# EAGLE design b295_rev0 (EAGLE 9.6.2)
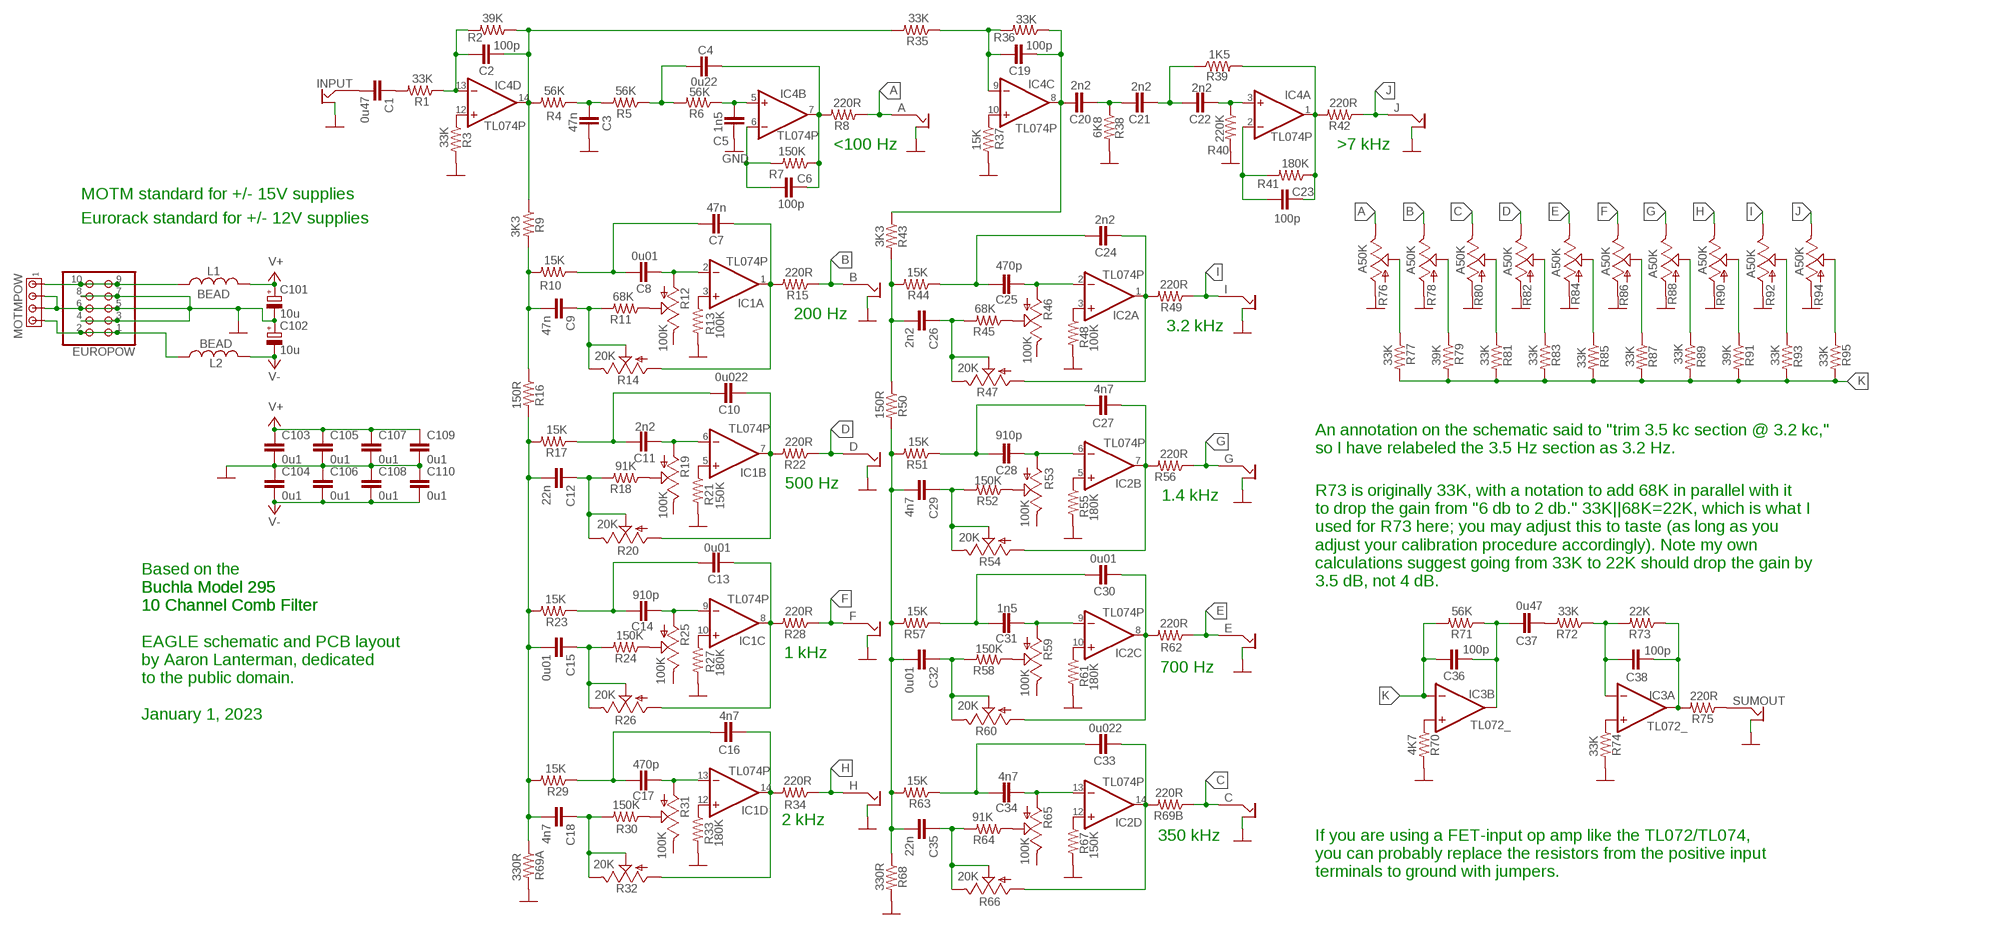
[diagram p0: schematic, sheet 1]

## Parts
A  OFFBOARD2JACKALT_AARON  [OFFBOARD2JACKALT]
B  OFFBOARD2JACKALT_AARON  [OFFBOARD2JACKALT]
C  OFFBOARD2JACKALT_AARON  [OFFBOARD2JACKALT]
C1  0u47  C-EU050-025X075-AARON  [C050-025X075-AARON]
C2  100p  C-EU050-025X075-AARON  [C050-025X075-AARON]
C3  47n  C-EU050-025X075-AARON  [C050-025X075-AARON]
C4  0u22  C-EU050-025X075-AARON  [C050-025X075-AARON]
C5  1n5  C-EU050-025X075-AARON  [C050-025X075-AARON]
C6  100p  C-EU050-025X075-AARON  [C050-025X075-AARON]
C7  47n  C-EU050-025X075-AARON  [C050-025X075-AARON]
C8  0u01  C-EU050-025X075-AARON  [C050-025X075-AARON]
C9  47n  C-EU050-025X075-AARON  [C050-025X075-AARON]
C10  0u022  C-EU050-025X075-AARON  [C050-025X075-AARON]
C11  2n2  C-EU050-025X075-AARON  [C050-025X075-AARON]
C12  22n  C-EU050-025X075-AARON  [C050-025X075-AARON]
C13  0u01  C-EU050-025X075-AARON  [C050-025X075-AARON]
C14  910p  C-EU050-025X075-AARON  [C050-025X075-AARON]
C15  0u01  C-EU050-025X075-AARON  [C050-025X075-AARON]
C16  4n7  C-EU050-025X075-AARON  [C050-025X075-AARON]
C17  470p  C-EU050-025X075-AARON  [C050-025X075-AARON]
C18  4n7  C-EU050-025X075-AARON  [C050-025X075-AARON]
C19  100p  C-EU050-025X075-AARON  [C050-025X075-AARON]
C20  2n2  C-EU050-025X075-AARON  [C050-025X075-AARON]
C21  2n2  C-EU050-025X075-AARON  [C050-025X075-AARON]
C22  2n2  C-EU050-025X075-AARON  [C050-025X075-AARON]
C23  100p  C-EU050-025X075-AARON  [C050-025X075-AARON]
C24  2n2  C-EU050-025X075-AARON  [C050-025X075-AARON]
C25  470p  C-EU050-025X075-AARON  [C050-025X075-AARON]
C26  2n2  C-EU050-025X075-AARON  [C050-025X075-AARON]
C27  4n7  C-EU050-025X075-AARON  [C050-025X075-AARON]
C28  910p  C-EU050-025X075-AARON  [C050-025X075-AARON]
C29  4n7  C-EU050-025X075-AARON  [C050-025X075-AARON]
C30  0u01  C-EU050-025X075-AARON  [C050-025X075-AARON]
C31  1n5  C-EU050-025X075-AARON  [C050-025X075-AARON]
C32  0u01  C-EU050-025X075-AARON  [C050-025X075-AARON]
C33  0u022  C-EU050-025X075-AARON  [C050-025X075-AARON]
C34  4n7  C-EU050-025X075-AARON  [C050-025X075-AARON]
C35  22n  C-EU050-025X075-AARON  [C050-025X075-AARON]
C36  100p  C-EU050-025X075-AARON  [C050-025X075-AARON]
C37  0u47  C-EU050-025X075-AARON  [C050-025X075-AARON]
C38  100p  C-EU050-025X075-AARON  [C050-025X075-AARON]
C101  10u  CPOL-EUE1.8-4  [E1,8-4]
C102  10u  CPOL-EUE1.8-4  [E1,8-4]
C103  0u1  C-EU050-025X075-AARON  [C050-025X075-AARON]
C104  0u1  C-EU050-025X075-AARON  [C050-025X075-AARON]
C105  0u1  C-EU050-025X075-AARON  [C050-025X075-AARON]
C106  0u1  C-EU050-025X075-AARON  [C050-025X075-AARON]
C107  0u1  C-EU050-025X075-AARON  [C050-025X075-AARON]
C108  0u1  C-EU050-025X075-AARON  [C050-025X075-AARON]
C109  0u1  C-EU050-025X075-AARON  [C050-025X075-AARON]
C110  0u1  C-EU050-025X075-AARON  [C050-025X075-AARON]
D  OFFBOARD2JACKALT_AARON  [OFFBOARD2JACKALT]
E  OFFBOARD2JACKALT_AARON  [OFFBOARD2JACKALT]
EUROPOW  PINHD-2X5  [2X05]
F  OFFBOARD2JACKALT_AARON  [OFFBOARD2JACKALT]
G  OFFBOARD2JACKALT_AARON  [OFFBOARD2JACKALT]
H  OFFBOARD2JACKALT_AARON  [OFFBOARD2JACKALT]
I  OFFBOARD2JACKALT_AARON  [OFFBOARD2JACKALT]
IC1  TL074P  [DIL14]
IC2  TL074P  [DIL14]
IC3  TL072_  [DIL08]
IC4  TL074P  [DIL14]
INPUT  OFFBOARD2JACKALT_AARON  [OFFBOARD2JACKALT]
J  OFFBOARD2JACKALT_AARON  [OFFBOARD2JACKALT]
L1  BEAD  L-US0207/10  [0207/10]
L2  BEAD  L-US0207/10  [0207/10]
MOTMPOW  MTA04-156  [1X4MTA]
R1  33K  R-US_0207/10  [0207/10]
R2  39K  R-US_0207/10  [0207/10]
R3  33K  R-US_0207/10  [0207/10]
R4  56K  R-US_0207/10  [0207/10]
R5  56K  R-US_0207/10  [0207/10]
R6  56K  R-US_0207/10  [0207/10]
R7  150K  R-US_0207/10  [0207/10]
R8  220R  R-US_0207/10  [0207/10]
R9  3K3  R-US_0207/10  [0207/10]
R10  15K  R-US_0207/10  [0207/10]
R11  68K  R-US_0207/10  [0207/10]
R12  100K  TRIM_US-B64Y  [B64Y]
R13  100K  R-US_0207/10  [0207/10]
R14  20K  TRIM_US-B64Y  [B64Y]
R15  220R  R-US_0207/10  [0207/10]
R16  150R  R-US_0207/10  [0207/10]
R17  15K  R-US_0207/10  [0207/10]
R18  91K  R-US_0207/10  [0207/10]
R19  100K  TRIM_US-B64Y  [B64Y]
R20  20K  TRIM_US-B64Y  [B64Y]
R21  150K  R-US_0207/10  [0207/10]
R22  220R  R-US_0207/10  [0207/10]
R23  15K  R-US_0207/10  [0207/10]
R24  150K  R-US_0207/10  [0207/10]
R25  100K  TRIM_US-B64Y  [B64Y]
R26  20K  TRIM_US-B64Y  [B64Y]
R27  180K  R-US_0207/10  [0207/10]
R28  220R  R-US_0207/10  [0207/10]
R29  15K  R-US_0207/10  [0207/10]
R30  150K  R-US_0207/10  [0207/10]
R31  100K  TRIM_US-B64Y  [B64Y]
R32  20K  TRIM_US-B64Y  [B64Y]
R33  180K  R-US_0207/10  [0207/10]
R34  220R  R-US_0207/10  [0207/10]
R35  33K  R-US_0207/10  [0207/10]
R36  33K  R-US_0207/10  [0207/10]
R37  15K  R-US_0207/10  [0207/10]
R38  6K8  R-US_0207/10  [0207/10]
R39  1K5  R-US_0207/10  [0207/10]
R40  220K  R-US_0207/10  [0207/10]
R41  180K  R-US_0207/10  [0207/10]
R42  220R  R-US_0207/10  [0207/10]
R43  3K3  R-US_0207/10  [0207/10]
R44  15K  R-US_0207/10  [0207/10]
R45  68K  R-US_0207/10  [0207/10]
R46  100K  TRIM_US-B64Y  [B64Y]
R47  20K  TRIM_US-B64Y  [B64Y]
R48  100K  R-US_0207/10  [0207/10]
R49  220R  R-US_0207/10  [0207/10]
R50  150R  R-US_0207/10  [0207/10]
R51  15K  R-US_0207/10  [0207/10]
R52  150K  R-US_0207/10  [0207/10]
R53  100K  TRIM_US-B64Y  [B64Y]
R54  20K  TRIM_US-B64Y  [B64Y]
R55  180K  R-US_0207/10  [0207/10]
R56  220R  R-US_0207/10  [0207/10]
R57  15K  R-US_0207/10  [0207/10]
R58  150K  R-US_0207/10  [0207/10]
R59  100K  TRIM_US-B64Y  [B64Y]
R60  20K  TRIM_US-B64Y  [B64Y]
R61  180K  R-US_0207/10  [0207/10]
R62  220R  R-US_0207/10  [0207/10]
R63  15K  R-US_0207/10  [0207/10]
R64  91K  R-US_0207/10  [0207/10]
R65  100K  TRIM_US-B64Y  [B64Y]
R66  20K  TRIM_US-B64Y  [B64Y]
R67  150K  R-US_0207/10  [0207/10]
R68  330R  R-US_0207/10  [0207/10]
R69A  330R  R-US_0207/10  [0207/10]
R69B  220R  R-US_0207/10  [0207/10]
R70  4K7  R-US_0207/10  [0207/10]
R71  56K  R-US_0207/10  [0207/10]
R72  33K  R-US_0207/10  [0207/10]
R73  22K  R-US_0207/10  [0207/10]
R74  33K  R-US_0207/10  [0207/10]
R75  220R  R-US_0207/10  [0207/10]
R76  A50K  TRIM_US-B64Y  [B64Y]
R77  33K  R-US_0207/10  [0207/10]
R78  A50K  TRIM_US-B64Y  [B64Y]
R79  39K  R-US_0207/10  [0207/10]
R80  A50K  TRIM_US-B64Y  [B64Y]
R81  33K  R-US_0207/10  [0207/10]
R82  A50K  TRIM_US-B64Y  [B64Y]
R83  33K  R-US_0207/10  [0207/10]
R84  A50K  TRIM_US-B64Y  [B64Y]
R85  33K  R-US_0207/10  [0207/10]
R86  A50K  TRIM_US-B64Y  [B64Y]
R87  33K  R-US_0207/10  [0207/10]
R88  A50K  TRIM_US-B64Y  [B64Y]
R89  33K  R-US_0207/10  [0207/10]
R90  A50K  TRIM_US-B64Y  [B64Y]
R91  39K  R-US_0207/10  [0207/10]
R92  A50K  TRIM_US-B64Y  [B64Y]
R93  33K  R-US_0207/10  [0207/10]
R94  A50K  TRIM_US-B64Y  [B64Y]
R95  33K  R-US_0207/10  [0207/10]
SUMOUT  OFFBOARD2JACKALT_AARON  [OFFBOARD2JACKALT]

## Nets
A: A.SIGNAL R8.1 R76.E
B: B.SIGNAL R15.1 R78.E
C: C.SIGNAL R69B.1 R80.E
C18A: C18.1 R30.2 R32.E R32.S
C32A: C32.1 R58.2 R60.E R60.S
D: D.SIGNAL R22.1 R82.E
E: E.SIGNAL R62.1 R84.E
F: F.SIGNAL R28.1 R86.E
G: G.SIGNAL R56.1 R88.E
GND: A.GND B.GND C3.1 C5.1 C101.- C102.+ C103.2 C104.1 C105.2 C106.1 C107.2 C108.1 C109.2 C110.1 C.GND D.GND E.GND EUROPOW.3 EUROPOW.4 EUROPOW.5 EUROPOW.6 EUROPOW.7 EUROPOW.8 F.GND G.GND H.GND I.GND INPUT.GND J.GND MOTMPOW.2 MOTMPOW.3 R3.2 R13.2 R21.2 R27.2 R33.2 R37.2 R38.2 R40.2 R48.2 R55.2 R61.2 R67.2 R68.2 R69A.2 R70.2 R74.2 R76.A R78.A R80.A R82.A R84.A R86.A R88.A R90.A R92.A R94.A SUMOUT.GND
H: H.SIGNAL R34.1 R90.E
I: I.SIGNAL R49.1 R92.E
J: J.SIGNAL R42.1 R94.E
K: C36.2 IC3.6(B:-IN) R71.2 R77.2 R79.2 R81.2 R83.2 R85.2 R87.2 R89.2 R91.2 R93.2 R95.2
N$1: C13.1 IC1.8(C:OUT) R26.A R28.2
N$2: C16.1 IC1.14(D:OUT) R32.A R34.2
N$3: C30.1 IC2.8(C:OUT) R60.A R62.2
N$4: C33.1 IC2.14(D:OUT) R66.A R69B.2
N$5: C14.1 IC1.9(C:-IN) R25.A
N$6: C17.1 IC1.13(D:-IN) R31.A
N$7: C16.2 C17.2 R29.1
N$8: C30.2 C31.2 R57.1
N$9: R24.1 R25.S
N$10: C33.2 C34.2 R63.1
N$11: R30.1 R31.S
N$12: R64.1 R65.S
N$13: R92.S R93.1
N$14: R94.S R95.1
N$15: C37.1 R72.2
N$16: IC1.3(A:+IN) R13.1
N$17: C13.2 C14.2 R23.1
N$18: C31.1 IC2.9(C:-IN) R59.A
N$19: C34.1 IC2.13(D:-IN) R65.A
N$20: R58.1 R59.S
N$21: C15.1 R24.2 R26.E R26.S
N$22: C38.2 IC3.2(A:-IN) R72.1 R73.2
N$23: C35.1 R64.2 R66.E R66.S
N$24: C36.1 C37.2 IC3.7(B:OUT) R71.1
N$25: IC1.5(B:+IN) R21.1
N$26: C12.2 C15.2 C18.2 R16.2 R17.2 R23.2 R29.2 R69A.1
N$27: IC1.10(C:+IN) R27.1
N$28: C29.2 C32.2 C35.2 R50.2 R51.2 R57.2 R63.2 R68.1
N$29: C7.1 IC1.1(A:OUT) R14.A R15.2
N$30: C10.1 IC1.7(B:OUT) R20.A R22.2
N$31: IC1.12(D:+IN) R33.1
N$32: IC2.12(D:+IN) R67.1
N$33: C24.1 IC2.1(A:OUT) R47.A R49.2
N$34: C27.1 IC2.7(B:OUT) R54.A R56.2
N$35: C8.1 IC1.2(A:-IN) R12.A
N$36: C10.2 C11.2 R17.1
N$37: C24.2 C25.2 R44.1
N$38: C27.2 C28.2 R51.1
N$39: C38.1 IC3.1(A:OUT) R73.1 R75.2
N$40: R75.1 SUMOUT.SIGNAL
N$41: R76.S R77.1
N$42: R78.S R79.1
N$43: C7.2 C8.2 R10.1
N$44: C25.1 IC2.2(A:-IN) R46.A
N$45: C28.1 IC2.6(B:-IN) R53.A
N$46: C11.1 IC1.6(B:-IN) R19.A
N$47: R11.1 R12.S
N$48: R18.1 R19.S
N$49: R52.1 R53.S
N$50: R45.1 R46.S
N$51: C9.1 R11.2 R14.E R14.S
N$52: C12.1 R18.2 R20.E R20.S
N$53: C29.1 R52.2 R54.E R54.S
N$54: C26.1 R45.2 R47.E R47.S
N$55: C9.2 R9.2 R10.2 R16.1
N$56: IC2.10(C:+IN) R61.1
N$57: C26.2 R43.2 R44.2 R50.1
N$58: IC2.5(B:+IN) R55.1
N$59: R80.S R81.1
N$60: R82.S R83.1
N$61: R84.S R85.1
N$62: EUROPOW.9 EUROPOW.10 L1.1 MOTMPOW.1
N$63: EUROPOW.1 EUROPOW.2 L2.1 MOTMPOW.4
N$64: R86.S R87.1
N$65: R88.S R89.1
N$66: R90.S R91.1
N$67: C3.2 R4.1 R5.2
N$68: C4.2 R5.1 R6.2
N$69: C4.1 C6.1 IC4.7(B:OUT) R7.1 R8.2
N$70: C5.2 IC4.5(B:+IN) R6.1
N$71: C6.2 IC4.6(B:-IN) R7.2
N$72: C2.1 IC4.14(D:OUT) R2.1 R4.2 R9.1 R35.2
N$73: C2.2 IC4.13(D:-IN) R1.1 R2.2
N$74: IC4.12(D:+IN) R3.1
N$75: C1.1 R1.2
N$76: C1.2 INPUT.SIGNAL
N$77: C19.2 IC4.9(C:-IN) R35.1 R36.2
N$78: C19.1 C20.2 IC4.8(C:OUT) R36.1 R43.1
N$79: C20.1 C21.2 R38.1
N$80: C21.1 C22.2 R39.1
N$81: C22.1 IC4.3(A:+IN) R40.1
N$82: C23.2 IC4.2(A:-IN) R41.2
N$83: C23.1 IC4.1(A:OUT) R39.2 R41.1 R42.2
N$84: IC2.3(A:+IN) R48.1
N$85: IC4.10(C:+IN) R37.1
N$94: IC3.5(B:+IN) R70.1
N$95: IC3.3(A:+IN) R74.1
V+: C101.+ C103.1 C105.1 C107.1 C109.1 L1.2
V-: C102.- C104.2 C106.2 C108.2 C110.2 L2.2
Unconnected: R12.E R19.E R25.E R31.E R46.E R53.E R59.E R65.E

## Notes on the sheet
- <100 Hz | >7 kHz
- MOTM standard for +/- 15V supplies
- Eurorack standard for +/- 12V supplies
- 200 Hz
- 3.2 kHz
- An annotation on the schematic said to "trim 3.5 kc section @ 3.2 kc," 
  so I have relabeled the 3.5 Hz section as 3.2 Hz.
- 500 Hz
- 1.4 kHz
- R73 is originally 33K, with a notation to add 68K in parallel with it
  to drop the gain from "6 db to 2 db." 33K||68K=22K, which is what I
  used for R73 here; you may adjust this to taste (as long as you
  adjust your calibration procedure accordingly). Note my own
  calculations suggest going from 33K to 22K should drop the gain by 
  3.5 dB, not 4 dB.
- Buchla Model 295
  10 Channel Comb Filter
- Based on the
  Buchla Model 295
  10 Channel Comb Filter
- 1 kHz
- 700 Hz
- EAGLE schematic and PCB layout
  by Aaron Lanterman, dedicated
  to the public domain.
  
  January 1, 2023
- 2 kHz
- 350 kHz
- If you are using a FET-input op amp like the TL072/TL074, 
  you can probably replace the resistors from the positive input
  terminals to ground with jumpers.

## Power pins joined to a net without a drawn wire
V+: IC1.4(P:V+) IC2.4(P:V+) IC3.8(P:V+) IC4.4(P:V+)
V-: IC1.11(P:V-) IC2.11(P:V-) IC3.4(P:V-) IC4.11(P:V-)

## Library data of the parts
A B C D E F G H I INPUT J SUMOUT = aaronlibrary:OFFBOARD2JACKALT_AARON
C1-C38 C103-C110 = aaroncaps:C-EU: CAPACITOR, European symbol
C101 C102 = rcl:CPOL-EU: POLARIZED CAPACITOR, European symbol
EUROPOW = pinhead:PINHD-2X5: PIN HEADER
IC1 IC2 IC4 = linear:TL074: OP AMP
IC3 = MusicThingModular:TL072: Generic Dual Op Amp
L1 L2 = rcl:L-US: INDUCTOR, American symbol; SPICEPREFIX: L
MOTMPOW = con-amp:MTA04-156: AMP connector
R1-R11 R13 R15-R18 R21-R24 R27-R30 R33-R45 R48-R52 R55-R58 R61-R64 R67 R68 R69A R69B R70-R75 R77 R79 R81 R83 R85 R87 R89 R91 R93 R95 = rcl:R-US_: RESISTOR, American symbol
R12 R14 R19 R20 R25 R26 R31 R32 R46 R47 R53 R54 R59 R60 R65 R66 R76 R78 R80 R82 R84 R86 R88 R90 R92 R94 = pot:TRIM_US-: POTENTIOMETER

## Board
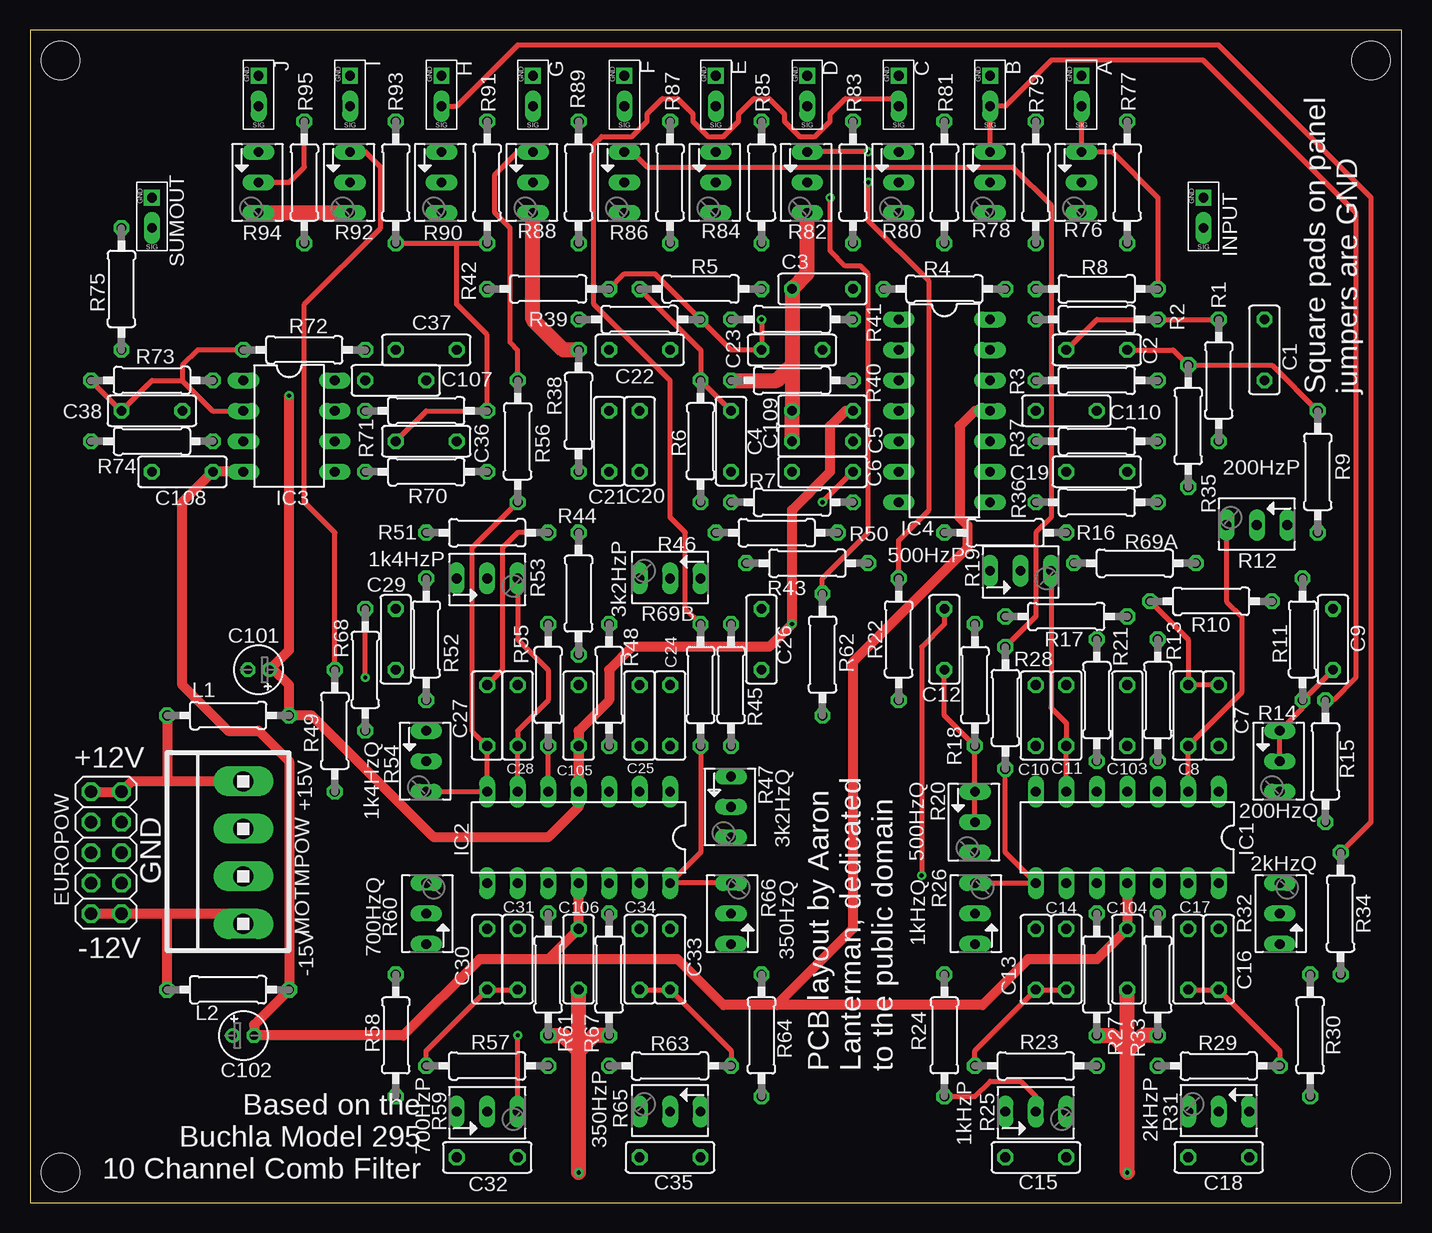
[diagram p1: board, top side]
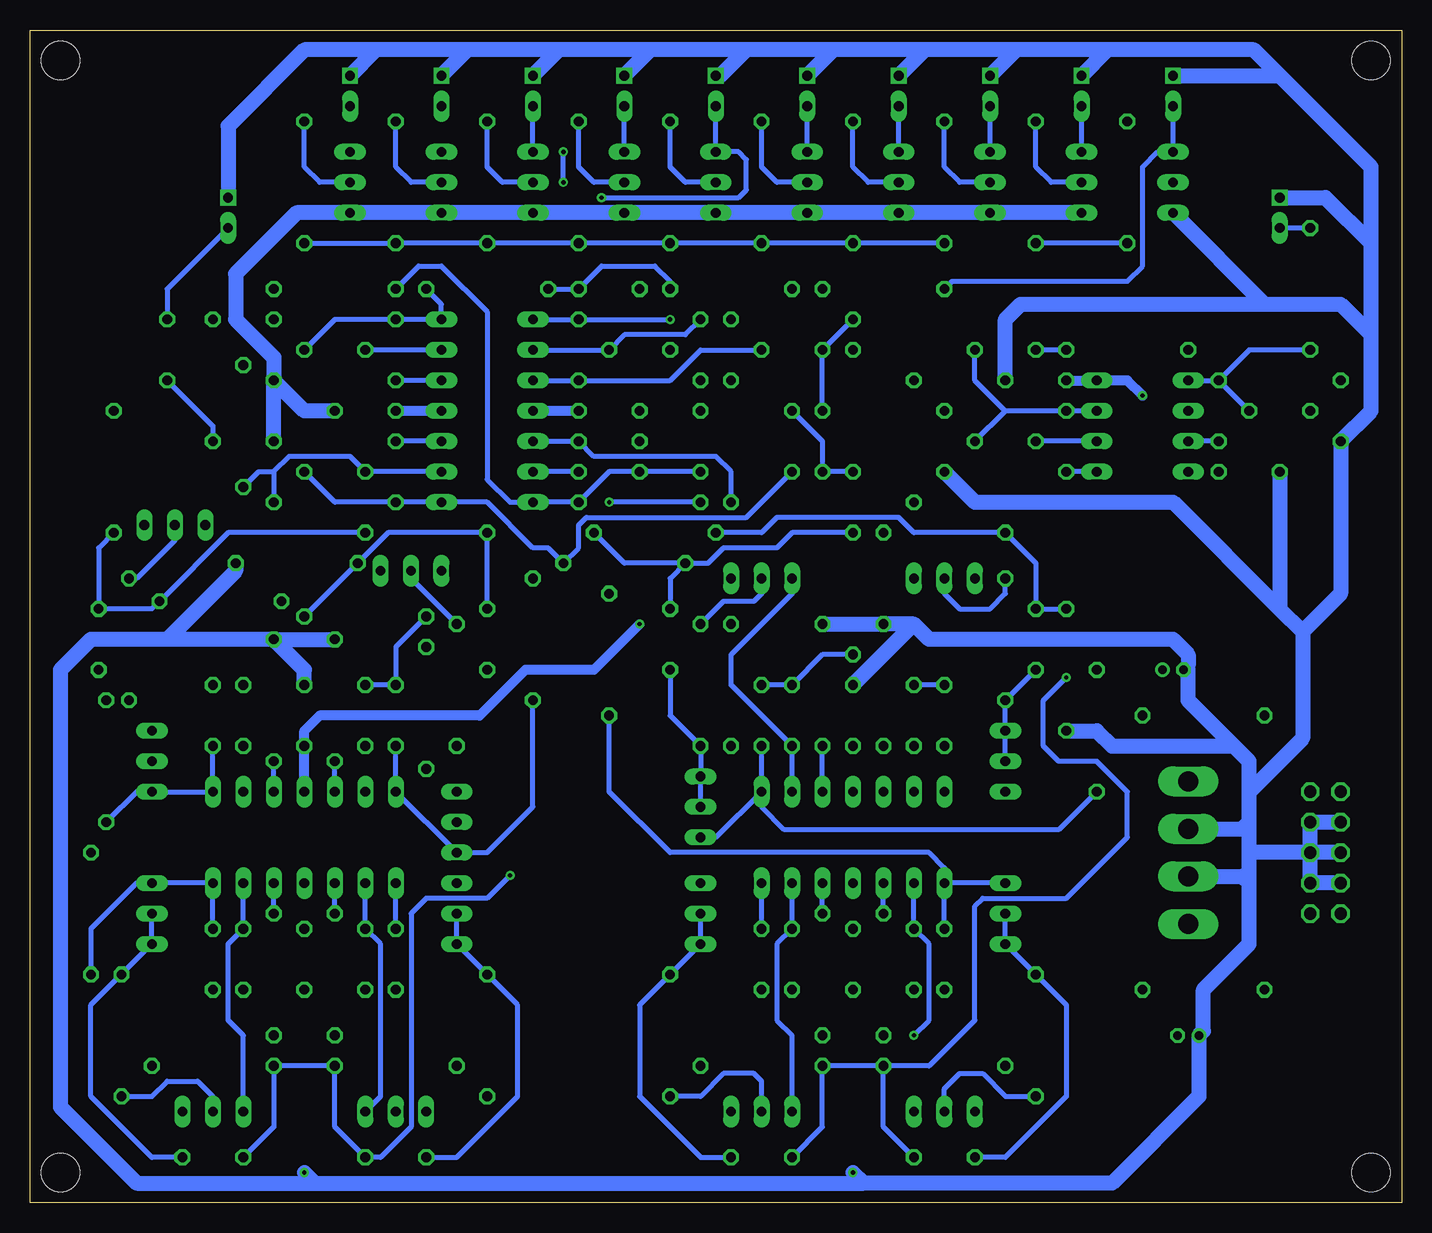
[diagram p2: board, bottom side, seen from below]

Size 114.3 x 97.79 mm. Coordinates in mm from the lower left corner, seen from the top.
Outline: 0,0 114.3,0 114.3,97.79 0,97.79 0,0
Copper layers (1*16): Top 0.035mm / dielectric 1.5mm / Bottom 0.035mm
Design rules "default": minimum track width 6mil, minimum drill 0.35mm, track to track 6mil, track to pad 6mil, pad to pad 6mil, via to via 6mil, smd to smd 6mil, copper to edge 40mil, drill to drill 6mil, minimum pad ring 10mil, minimum via ring 8mil, stop-mask expansion 4mil, vias tented up to drill 0mil, thermal gap 10mil
Holes 3.2 mm at 2.54,95.25 111.76,95.25 111.76,2.54 2.54,2.54

### Footprints (pad centres in the part's own frame; a part is rotated, then mirrored left to right if it is on the bottom)
OFFBOARD2JACKALT = drill 0.813 square: GND -1.27,-1.27 | drill 0.813 long: SIGNAL -1.27,1.27
C050-025X075-AARON = drill 0.813 octagon: 1 -2.54,0; 2 2.54,0
E1,8-4 = drill 0.711 pad 1.168: + -0.889,0 | drill 0.711 pad 1.168 octagon: - 0.889,0
2X05 = drill 1.016 octagon: 1 -5.08,-1.27; 2 -5.08,1.27; 3 -2.54,-1.27; 4 -2.54,1.27; 5 0,-1.27; 6 0,1.27; 7 2.54,-1.27; 8 2.54,1.27; 9 5.08,-1.27; 10 5.08,1.27
DIL14 = drill 0.813 long: 1 -7.62,-3.81; 2 -5.08,-3.81; 3 -2.54,-3.81; 4 0,-3.81; 5 2.54,-3.81; 6 5.08,-3.81; 7 7.62,-3.81; 8 7.62,3.81; 9 5.08,3.81; 10 2.54,3.81; 11 0,3.81; 12 -2.54,3.81; 13 -5.08,3.81; 14 -7.62,3.81
DIL08 = drill 0.813 pad 1.27 long: 1 -3.81,-3.81; 2 -1.27,-3.81; 3 1.27,-3.81; 4 3.81,-3.81; 5 3.81,3.81; 6 1.27,3.81; 7 -1.27,3.81; 8 -3.81,3.81
0207/10 = drill 0.813 octagon: 1 -5.08,0; 2 5.08,0
1X4MTA = drill 1.676 long: 1 5.944,0; 2 1.981,0; 3 -1.981,0; 4 -5.944,0
B64Y = drill 0.813 long: A 2.54,0; E -2.54,0; S 0,0

### Placement (x,y rotation side)
A  86.36,92.71 180 top
B  78.74,92.71 180 top
C  71.12,92.71 180 top
C1  102.87,71.12 90 top
C2  88.9,71.12 180 top
C3  66.04,76.2 0 top
C4  58.42,63.5 90 top
C5  66.04,63.5 0 top
C6  66.04,60.96 0 top
C7  99.06,40.64 90 top
C8  96.52,40.64 90 top
C9  108.58,46.99 90 top
C10  83.82,40.64 90 top
C11  86.36,40.64 90 top
C12  76.2,46.99 90 top
C13  83.82,20.32 270 top
C14  86.36,20.32 270 top
C15  83.82,3.81 0 top
C16  99.06,20.32 270 top
C17  96.52,20.32 270 top
C18  99.06,3.81 180 top
C19  88.9,60.96 180 top
C20  50.8,63.5 270 top
C21  48.26,63.5 270 top
C22  50.8,71.12 180 top
C23  63.5,71.12 0 top
C24  53.34,40.64 90 top
C25  50.8,40.64 90 top
C26  60.96,46.99 90 top
C27  38.1,40.64 90 top
C28  40.64,40.64 90 top
C29  30.48,46.99 90 top
C30  38.1,20.32 270 top
C31  40.64,20.32 270 top
C32  38.1,3.81 0 top
C33  53.34,20.32 270 top
C34  50.8,20.32 270 top
C35  53.34,3.81 180 top
C36  33.02,63.5 180 top
C37  33.02,71.12 0 top
C38  10.16,66.04 180 top
C101  19.05,44.45 180 top
C102  17.78,13.97 0 top
C103  91.44,40.64 90 top
C104  91.44,20.32 90 top
C105  45.72,40.64 90 top
C106  45.72,20.32 90 top
C107  30.48,68.58 0 top
C108  12.7,60.96 0 top
C109  66.04,66.04 180 top
C110  86.36,66.04 180 top
D  63.5,92.71 180 top
E  55.88,92.71 180 top
EUROPOW  6.35,29.21 90 top
F  48.26,92.71 180 top
G  40.64,92.71 180 top
H  33.02,92.71 180 top
I  25.4,92.71 180 top
IC1  91.44,30.48 180 top
IC2  45.72,30.48 180 top
IC3  21.59,64.77 270 top
IC4  76.2,66.04 270 top
INPUT  96.52,82.55 180 top
J  17.78,92.71 180 top
L1  16.51,40.64 0 top
L2  16.51,17.78 0 top
MOTMPOW  17.78,29.21 90 top
R1  99.06,68.58 270 top
R2  88.9,73.66 0 top
R3  88.9,68.58 0 top
R4  76.2,76.2 0 top
R5  55.88,76.2 0 top
R6  55.88,63.5 90 top
R7  63.5,58.42 180 top
R8  88.9,76.2 180 top
R9  107.31,60.96 270 top
R10  98.42,50.16 0 top
R11  106.05,46.99 270 top
R12  102.23,56.52 180 top
R13  93.98,41.91 90 top
R14  104.14,36.83 270 top
R15  107.95,36.83 270 top
R16  81.28,55.88 180 top
R17  86.36,48.9 0 top
R18  78.74,43.18 270 top
R19  82.55,52.7 0 top
R20  78.74,31.75 270 top
R21  88.9,41.91 90 top
R22  72.39,46.99 270 top
R23  83.82,11.43 0 top
R24  76.2,13.97 90 top
R25  83.82,7.62 0 top
R26  78.74,24.13 90 top
R27  88.9,19.05 270 top
R28  81.28,41.27 270 top
R29  99.06,11.43 180 top
R30  106.68,13.97 90 top
R31  99.06,7.62 180 top
R32  104.14,24.13 90 top
R33  93.98,19.05 270 top
R34  109.22,24.13 270 top
R35  96.52,64.77 90 top
R36  88.9,58.42 0 top
R37  88.9,63.5 0 top
R38  45.72,66.04 90 top
R39  50.8,73.66 0 top
R40  63.5,68.58 180 top
R41  63.5,73.66 180 top
R42  43.18,76.2 0 top
R43  64.77,53.34 180 top
R44  45.72,50.8 90 top
R45  58.42,43.18 270 top
R46  53.34,52.07 180 top
R47  58.42,33.02 270 top
R48  48.26,43.18 90 top
R49  25.4,39.37 270 top
R50  62.23,55.88 180 top
R51  38.1,55.88 180 top
R52  33.02,46.99 270 top
R53  38.1,52.07 0 top
R54  33.02,36.83 270 top
R55  43.18,43.18 90 top
R56  40.64,63.5 270 top
R57  38.1,11.43 0 top
R58  30.48,13.97 90 top
R59  38.1,7.62 0 top
R60  33.02,24.13 90 top
R61  43.18,19.05 270 top
R62  66.04,45.72 270 top
R63  53.34,11.43 180 top
R64  60.96,13.97 90 top
R65  53.34,7.62 180 top
R66  58.42,24.13 90 top
R67  48.26,19.05 270 top
R68  27.94,44.45 270 top
R69A  92.08,53.34 0 top
R69B  55.88,43.18 270 top
R70  33.02,60.96 0 top
R71  33.02,66.04 0 top
R72  22.86,71.12 0 top
R73  10.16,68.58 180 top
R74  10.16,63.5 180 top
R75  7.62,76.2 270 top
R76  87.63,85.09 270 top
R77  91.44,85.09 270 top
R78  80.01,85.09 270 top
R79  83.82,85.09 270 top
R80  72.39,85.09 270 top
R81  76.2,85.09 270 top
R82  64.77,85.09 270 top
R83  68.58,85.09 270 top
R84  57.15,85.09 270 top
R85  60.96,85.09 270 top
R86  49.53,85.09 270 top
R87  53.34,85.09 270 top
R88  41.91,85.09 270 top
R89  45.72,85.09 270 top
R90  34.29,85.09 270 top
R91  38.1,85.09 270 top
R92  26.67,85.09 270 top
R93  30.48,85.09 270 top
R94  19.05,85.09 270 top
R95  22.86,85.09 270 top
SUMOUT  8.89,82.55 180 top

### Tracks (layer width: path | path; a pad name or v marks a point on that pad's centre or on a via)
A
  Top 0.406: R8.1 93.98,83.82 90.17,87.63 R76.E A.SIGNAL
B
  Top 0.406: R15.1 108.58,41.91 110.49,43.81 110.49,82.55 97.79,95.25 85.09,95.25 81.28,91.44 B.SIGNAL R78.E
C
  Top 0.406: R69B.1 54.61,49.53 54.61,55.88 53.34,57.15 53.34,68.58 46.99,74.93 46.99,88.27 47.62,88.9 50.16,88.9 51.44,90.17 51.44,90.81 52.7,92.08 53.98,92.08 55.24,90.81 55.24,90.17 56.52,88.9 57.78,88.9 59.05,90.17 59.05,90.81 60.33,92.08 61.59,92.08 62.87,90.81 62.87,90.17 64.14,88.9 65.41,88.9 66.67,90.17 66.67,90.81 67.94,92.08 71.75,92.08 C.SIGNAL
  Bottom 0.406: R80.E C.SIGNAL
C18A
  Bottom 0.406: C18.1 104.14,3.81 109.22,8.89 109.22,16.51 R30.2 R32.E R32.S
C32A
  Bottom 0.406: R60.S R60.E R58.2 27.94,16.51 27.94,8.89 33.02,3.81 C32.1
D  (via drill 0.35)
  Top 0.406: R22.1 72.39,55.24 74.93,57.78 74.93,76.83 69.85,81.92 v69.85,85.09 | v69.85,87.63 R82.E
  Bottom 0.406: R82.E D.SIGNAL | v69.85,85.09 v69.85,87.63
E  (via drill 0.35)
  Top 0.406: R62.1 66.04,52.07 69.85,55.88 69.85,77.47 69.22,78.11 67.94,78.11 66.67,79.38 v66.67,83.82
  Bottom 0.406: E.SIGNAL R84.E 55.24,87.63 54.61,87 54.61,84.45 55.24,83.82 v66.67,83.82
F
  Top 0.406: R86.E 50.16,87.63 51.44,86.36 81.92,86.36 85.09,83.19 85.09,57.15 83.82,55.88 83.82,48.9 R28.1
  Bottom 0.406: R86.E F.SIGNAL
G
  Top 0.406: R56.1 40.64,71.12 40.01,71.75 40.01,81.28 38.73,82.55 38.73,85.72 40.64,87.63 R88.E
  Bottom 0.406: R88.E G.SIGNAL
GND  (via drill 0.35)
  Top 1.27: R94.A R92.A | R82.A 64.77,77.47 C3.1 63.5,69.85 | 63.5,69.85 C109.2 C5.1 | R40.2 62.23,68.58 63.5,69.85 | v45.72,2.54 45.72,12.7 | 45.72,12.7 C106.1 | R38.2 44.45,71.12 41.91,73.66 R88.A | R61.2 44.45,13.97 45.72,12.7 | R67.2 46.99,13.97 45.72,12.7 | v91.44,2.54 91.44,12.7 | 91.44,12.7 C104.1 | R27.2 90.17,13.97 91.44,12.7 | R33.2 92.71,13.97 91.44,12.7
  Bottom 1.27: 24.51,96.14 12.32,96.14 10.16,93.98 | 24.51,96.14 32.13,96.14 | 32.13,96.14 39.75,96.14 | 39.75,96.14 47.37,96.14 | 47.37,96.14 54.61,96.14 | 54.61,96.14 62.61,96.14 | 62.61,96.14 70.23,96.14 | 70.23,96.14 77.85,96.14 | 77.85,96.14 85.47,96.14 | 85.47,96.14 91.44,96.14 97.79,89.79 INPUT.GND | 2.54,72.39 2.54,80.01 | 2.54,80.01 2.54,86.36 10.16,93.98 | A.GND 85.47,96.14 | B.GND 77.85,96.14 | C.GND 70.23,96.14 | D.GND 62.61,96.14 | E.GND 56.77,93.98 54.61,96.14 | F.GND 47.37,96.14 | G.GND 39.75,96.14 | H.GND 32.13,96.14 | I.GND 24.51,96.14 | J.GND 10.16,93.98 | SUMOUT.GND 6.35,83.82 2.54,80.01 | R94.A 11.43,74.93 | 11.43,74.93 5.08,74.93 2.54,72.39 | R92.A R90.A R88.A R86.A R84.A R82.A R80.A R78.A R76.A 92.08,82.55 97.16,77.47 97.16,73.66 93.98,70.48 R3.2 | 12.7,31.75 13.26,31.19 MOTMPOW.2 | 12.7,31.75 12.7,34.29 | 12.7,34.29 12.7,36.83 13.97,38.1 | 13.97,38.1 17.78,41.91 17.78,44.45 C101.- 17.78,44.83 17.78,45.72 19.05,46.99 39.37,46.99 40.64,48.26 | 12.7,26.67 13.26,27.23 MOTMPOW.3 | 12.7,26.67 12.7,29.21 | 12.7,29.21 12.7,31.75 | C107.2 33.02,73.66 31.75,74.93 11.43,74.93 | R70.2 35.56,58.42 19.05,58.42 10.16,49.53 | C110.1 91.44,66.04 R3.2 | R37.2 R3.2 | 12.7,26.67 12.7,21.59 16.51,17.78 16.51,14.35 C102.+ 16.89,8.89 24.13,1.65 44.83,1.65 | EUROPOW.5 12.7,29.21 | EUROPOW.8 EUROPOW.7 EUROPOW.5 | EUROPOW.5 EUROPOW.3 EUROPOW.4 | R68.2 25.4,39.37 24.13,38.1 13.97,38.1 | v91.44,2.54 90.55,1.65 | 44.83,1.65 v45.72,2.54 | 90.55,1.65 44.83,1.65 | 90.55,1.65 105.41,1.65 111.76,8 111.76,44.45 109.22,46.99 102.87,46.99 | 10.16,49.53 8.26,47.62 | EUROPOW.6 EUROPOW.5 | 8.26,47.62 8.26,38.73 12.7,34.29 | 2.54,72.39 2.54,66.04 R74.2 5.08,50.8 8.26,47.62
  Bottom 1.27: C108.1 10.16,49.53 | 40.64,48.26 R55.2 R48.2 | C105.2 40.64,48.26 | R13.2 102.87,46.99 | R13.2 R21.2 | C103.2 91.44,44.45 R13.2 | R69A.2 97.16,52.7 102.87,46.99
H
  Top 0.406: R34.1 111.76,31.75 111.76,83.82 99.06,96.52 40.64,96.52 35.56,91.44 H.SIGNAL
  Bottom 0.406: R90.E H.SIGNAL
I
  Top 0.406: R49.1 25.4,55.88 22.86,58.42 22.86,74.93 29.21,81.28 29.21,86.36 27.94,87.63 R92.E
  Bottom 0.406: R92.E I.SIGNAL
J
  Bottom 0.406: J.SIGNAL R94.E 20.32,87.63 21.59,86.36 21.59,78.11 22.86,76.83 37.47,76.83 R42.1
K
  Top 0.406: R93.2 35.56,80.01 | 35.56,80.01 R91.2 | 35.56,80.01 35.56,74.93 38.1,72.39 R71.2 33.02,66.04 C36.2
  Bottom 0.406: R95.2 R93.2 | R91.2 R89.2 R87.2 R85.2 R83.2 R81.2 R79.2 R77.2 | IC3.6 C36.2
N$1
  Top 0.406: R26.A IC1.8 81.28,29.21 R28.2
  Bottom 0.406: C13.1 IC1.8
N$2
  Bottom 0.406: C16.1 IC1.14 R32.A 105.41,26.67 109.22,22.86 R34.2
N$3
  Bottom 0.406: C30.1 IC2.8 | R60.A IC2.8 | IC2.8 38.1,27.94 39.37,29.21 60.96,29.21 66.04,34.29 R62.2
N$4
  Top 0.406: R69B.2 55.88,29.21 IC2.14 R66.A
  Bottom 0.406: C33.1 IC2.14
N$5
  Bottom 0.406: R25.A 85.09,8.89 85.09,21.59 C14.1 IC1.9
N$6
  Bottom 0.406: R31.A 96.52,13.97 97.79,15.24 97.79,21.59 C17.1 IC1.13
N$7
  Top 0.406: C17.2 C16.2 104.14,12.7 R29.1
N$8
  Top 0.406: R57.1 33.02,12.7 C30.2 C31.2
N$9
  Top 0.406: R24.1 78.74,8.89 80.01,10.16 82.55,10.16 83.82,8.89 R25.S
N$10
  Top 0.406: C34.2 C33.2 58.42,12.7 R63.1
N$11
  Bottom 0.406: R30.1 104.14,8.89 102.87,10.16 100.33,10.16 99.06,8.89 R31.S
N$12
  Bottom 0.406: R65.S 53.34,10.16 53.98,10.79 56.52,10.79 58.42,8.89 R64.1
N$13
  Bottom 0.406: R92.S 29.21,85.09 30.48,86.36 R93.1
N$14
  Top 0.406: R94.S 21.59,85.09 22.86,86.36 R95.1
N$15
  Bottom 0.406: R72.2 C37.1
N$16
  Bottom 0.406: IC1.3 R13.1
N$17
  Top 0.406: R23.1 78.74,12.7 C13.2 C14.2
N$18  (via drill 0.35)
  Top 0.406: R59.A v40.64,13.97
  Bottom 0.406: v40.64,13.97 39.37,15.24 39.37,21.59 C31.1 IC2.9
N$19
  Bottom 0.406: R65.A 50.8,13.97 52.07,15.24 52.07,21.59 C34.1 IC2.13
N$20
  Bottom 0.406: R59.S 38.1,9.53 36.83,10.79 34.92,10.79 33.02,8.89 R58.1
N$21
  Bottom 0.406: C15.1 78.74,3.81 73.66,8.89 73.66,16.51 R24.2 R26.E R26.S
N$22
  Top 0.406: R72.1 13.97,71.12 12.7,69.85 12.7,68.58 | 12.7,68.58 15.24,66.04 IC3.2 | R73.2 C38.2 10.16,68.58 12.7,68.58
N$23
  Bottom 0.406: R66.S R66.E R64.2 63.5,16.51 63.5,8.89 58.42,3.81 C35.1
N$24
  Bottom 0.406: IC3.7 R71.1 33.02,66.04 | 33.02,66.04 35.56,68.58 C37.2 | C36.1 33.02,66.04
N$25
  Bottom 0.406: IC1.5 R21.1
N$26  (via drill 0.35)
  Top 0.406: C12.2 76.2,48.26 74.3,46.35 v74.3,27.3
  Bottom 0.406: v74.3,27.3 76.2,25.4 81.28,25.4 82.55,24.13 82.55,6.35 85.09,3.81 C15.2 88.9,6.35 R23.2 R29.2 93.98,6.35 C18.2 | C12.2 R16.2 84.45,55.88 R69A.1 R17.2
N$27
  Bottom 0.406: R27.1 IC1.10
N$28  (via drill 0.35)
  Top 0.406: v27.94,43.81 R68.1
  Bottom 0.406: R50.2 53.34,55.88 52.07,57.15 41.91,57.15 40.64,55.88 R51.2 30.48,53.34 C29.2 R68.1 | v27.94,43.81 29.84,41.91 29.84,38.1 28.57,36.83 25.4,36.83 22.86,34.29 22.86,30.48 27.94,25.4 34.92,25.4 35.56,24.77 35.56,15.24 39.37,11.43 R57.2 | R57.2 R63.2 48.26,6.35 C35.2 | C32.2 43.18,6.35 R57.2
N$29
  Bottom 0.406: C7.1 IC1.1 R14.A 105.41,34.29 R15.2
N$30
  Bottom 0.406: C10.1 IC1.7 R20.A 76.2,29.21 72.39,33.02 R22.2
N$31
  Bottom 0.406: R33.1 IC1.12
N$32
  Bottom 0.406: R67.1 IC2.12
N$33
  Bottom 0.406: IC2.1 C24.1 | IC2.1 57.15,30.48 R47.A | R49.2 28.57,31.11 51.44,31.11 53.34,33.02 IC2.1
N$34
  Top 0.406: R54.A IC2.7 C27.1 36.83,39.37 36.83,54.61 R56.2
N$35
  Top 0.406: R12.A 99.69,50.16 100.97,48.9 100.97,42.55 C8.1 IC1.2
N$36
  Bottom 0.406: C11.2 C10.2 83.82,46.35 R17.1
N$37
  Bottom 0.406: R44.1 48.26,45.72 C25.2 C24.2
N$38
  Top 0.406: R51.1 40.64,55.88 39.37,54.61 39.37,44.45 C27.2
  Bottom 0.406: C27.2 C28.2
N$39
  Bottom 0.406: IC3.1 R73.1 | R75.2 12.7,71.12 R73.1 | C38.1 R73.1
N$40
  Bottom 0.406: R75.1 SUMOUT.SIGNAL
N$41
  Bottom 0.406: R76.S 90.17,85.09 91.44,86.36 R77.1
N$42
  Bottom 0.406: R78.S 82.55,85.09 83.82,86.36 R79.1
N$43
  Top 0.406: R10.1 96.52,46.99 C8.2 C7.2
N$44
  Bottom 0.406: R46.A 50.8,50.8 55.88,45.72 55.88,43.18 C25.1 IC2.2
N$45
  Top 0.406: R53.A 40.64,46.99 43.18,44.45 43.18,41.91 40.64,39.37 C28.1 IC2.6
N$46
  Top 0.406: IC1.6 C11.1 86.36,40.01 85.09,41.27 R19.A
N$47
  Bottom 0.406: R12.S 102.23,55.24 105.41,52.07 R11.1
N$48
  Bottom 0.406: R18.1 82.55,52.07 R19.S
N$49
  Bottom 0.406: R53.S 38.1,50.8 36.83,49.53 34.29,49.53 33.02,50.8 R52.1
N$50
  Bottom 0.406: R46.S 53.34,50.8 53.98,50.16 56.52,50.16 R45.1
N$51
  Top 0.406: C9.1 R11.2 106.05,41.27 R14.E R14.S
N$52
  Top 0.406: C12.1 76.2,40.64 R18.2 R20.E R20.S
N$53
  Bottom 0.406: C29.1 R52.2 R54.E R54.S
N$54
  Bottom 0.406: C26.1 60.96,40.64 R45.2 R47.E R47.S
N$55
  Bottom 0.406: R9.2 108.58,54.61 C9.2 104.14,49.53 R10.2 97.79,55.88 R16.1
N$56
  Bottom 0.406: R61.1 IC2.10
N$57
  Bottom 0.406: R43.2 64.77,53.34 R50.1 | R43.2 60.96,52.07 C26.2 | R43.2 57.78,53.34 56.52,54.61 52.07,54.61 50.8,55.88 R44.2
N$58
  Top 0.406: IC2.5 R55.1
N$59
  Bottom 0.406: R80.S 74.93,85.09 76.2,86.36 R81.1
N$60
  Bottom 0.406: R82.S 67.31,85.09 68.58,86.36 R83.1
N$61
  Bottom 0.406: R84.S 59.69,85.09 60.96,86.36 R85.1
N$62
  Top 0.813: MOTMPOW.1 11.43,35.15 | 11.43,35.15 8.48,35.15 EUROPOW.9 EUROPOW.10 | L1.1 11.43,35.15
N$63
  Top 0.813: EUROPOW.2 EUROPOW.1 11.43,24.13 | 11.43,24.13 16.92,24.13 MOTMPOW.4 | L2.1 11.43,24.13
N$64
  Bottom 0.406: R86.S 52.07,85.09 53.34,86.36 R87.1
N$65
  Bottom 0.406: R88.S 44.45,85.09 45.72,86.36 R89.1
N$66
  Bottom 0.406: R90.S 36.83,85.09 38.1,86.36 R91.1
N$67
  Bottom 0.406: R4.1 C3.2 66.67,78.11 62.23,78.11 60.96,76.83 R5.2
N$68
  Top 0.406: C4.2 R6.2 55.88,71.12 R5.1
N$69
  Bottom 0.406: R8.2 81.92,78.11 80.01,78.11 76.2,74.3 76.2,60.33 74.3,58.42 IC4.7 R7.1 66.04,60.96 C6.1 C4.1
N$70
  Bottom 0.406: IC4.5 C5.2 67.31,62.23 57.15,62.23 55.88,60.96 R6.1
N$71  (via drill 0.35)
  Top 0.406: v66.04,58.42 C6.2
  Bottom 0.406: C6.2 IC4.6 | R7.2 v66.04,58.42
N$72
  Top 0.406: R9.1 103.5,69.85 R35.2 95.25,71.12 C2.1
  Bottom 0.406: C2.1 88.9,73.66 R2.1 IC4.14 80.01,74.93 R4.2
N$73
  Top 0.406: R1.1 R2.2 88.9,73.66 C2.2
  Bottom 0.406: IC4.13 C2.2
N$74
  Bottom 0.406: IC4.12 R3.1
N$75
  Bottom 0.406: C1.1 99.06,64.77 R1.2
N$76
  Bottom 0.406: INPUT.SIGNAL 102.87,76.2 C1.2
N$77
  Bottom 0.406: IC4.9 C19.2 87.63,62.23 92.71,62.23 93.98,60.96 | 93.98,60.96 R36.2 | R35.1 95.25,60.96 93.98,60.96
N$78
  Bottom 0.406: C19.1 88.9,58.42 R36.1 IC4.8 76.2,58.42 72.39,54.61 71.12,54.61 R43.1 68.58,54.61 68.58,56.52 67.94,57.15 54.61,57.15 C20.2
N$79
  Bottom 0.406: C20.1 48.26,63.5 C21.2 R38.1
N$80
  Bottom 0.406: R39.1 C22.2 C21.1
N$81
  Bottom 0.406: IC4.3 R40.1 60.96,68.58 58.42,71.12 C22.1
N$82
  Bottom 0.406: IC4.2 C23.2 64.77,72.39 59.69,72.39 R41.2
N$83  (via drill 0.35)
  Top 0.406: R42.2 49.53,77.47 52.07,77.47 R39.2 58.42,71.12 C23.1 v60.96,73.66
  Bottom 0.406: IC4.1 R41.1 v60.96,73.66
N$84
  Bottom 0.406: IC2.3 R48.1
N$85
  Bottom 0.406: IC4.10 R37.1
N$94
  Bottom 0.406: IC3.5 R70.1
N$95
  Bottom 0.406: R74.1 IC3.3
V+  (via drill 0.35)
  Top 0.813: IC2.4 C105.1 | v21.59,67.31 21.59,46.1 C101.+ 20.32,44.45 21.59,43.18 L1.2 23.5,40.64 33.66,30.48 43.18,30.48 45.72,33.02 C105.1 | C109.1 67.94,66.04 66.67,64.77 66.67,60.96 63.5,57.78 v63.5,48.26 61.59,46.35 50.16,46.35 48.26,44.45 48.26,41.91 45.72,39.37 C105.1
  Bottom 0.813: IC1.4 C103.1 91.44,39.37 90.17,40.64 76.83,40.64 73.03,44.45 67.31,44.45 v63.5,48.26 | C109.1 IC4.4 | C107.1 IC3.8 22.86,68.58 v21.59,67.31
V-
  Top 0.813: IC2.11 C106.2 43.18,20.32 | 43.18,20.32 37.47,20.32 31.11,13.97 C102.- 18.67,14.86 L2.2 21.59,36.83 19.05,39.37 16.51,39.37 12.7,43.18 12.7,58.42 C108.2 IC3.4 | IC1.11 C104.2 88.9,20.32 83.19,20.32 79.38,16.51 62.23,16.51 | 62.23,16.51 57.78,16.51 53.98,20.32 43.18,20.32 | 62.23,16.51 68.58,22.86 68.58,45.09 78.11,54.61 78.11,56.52 77.47,57.15 77.47,64.77 78.74,66.04 IC4.11
  Bottom 0.813: IC4.11 C110.2

### Text on the board
tNames: Square pads on panel / jumpers are GND | 200HzP | 1k4HzP | 500HzP | 3k2HzP | +12V | +15V | 200HzQ | 1k4HzQ | 3k2HzQ | 2kHzQ | 500HzQ | GND | 1kHzQ | 700HzQ | -12V | 350HzQ | -15V | PCB layout by Aaron / Lanterman, dedicated / to the public domain | Based on the / Buchla Model 295 / 10 Channel Comb Filter | 350HzP | 1kHzP | 2kHzP | 700HzP